# Altium schematic sheet bias.SchDoc
size A2
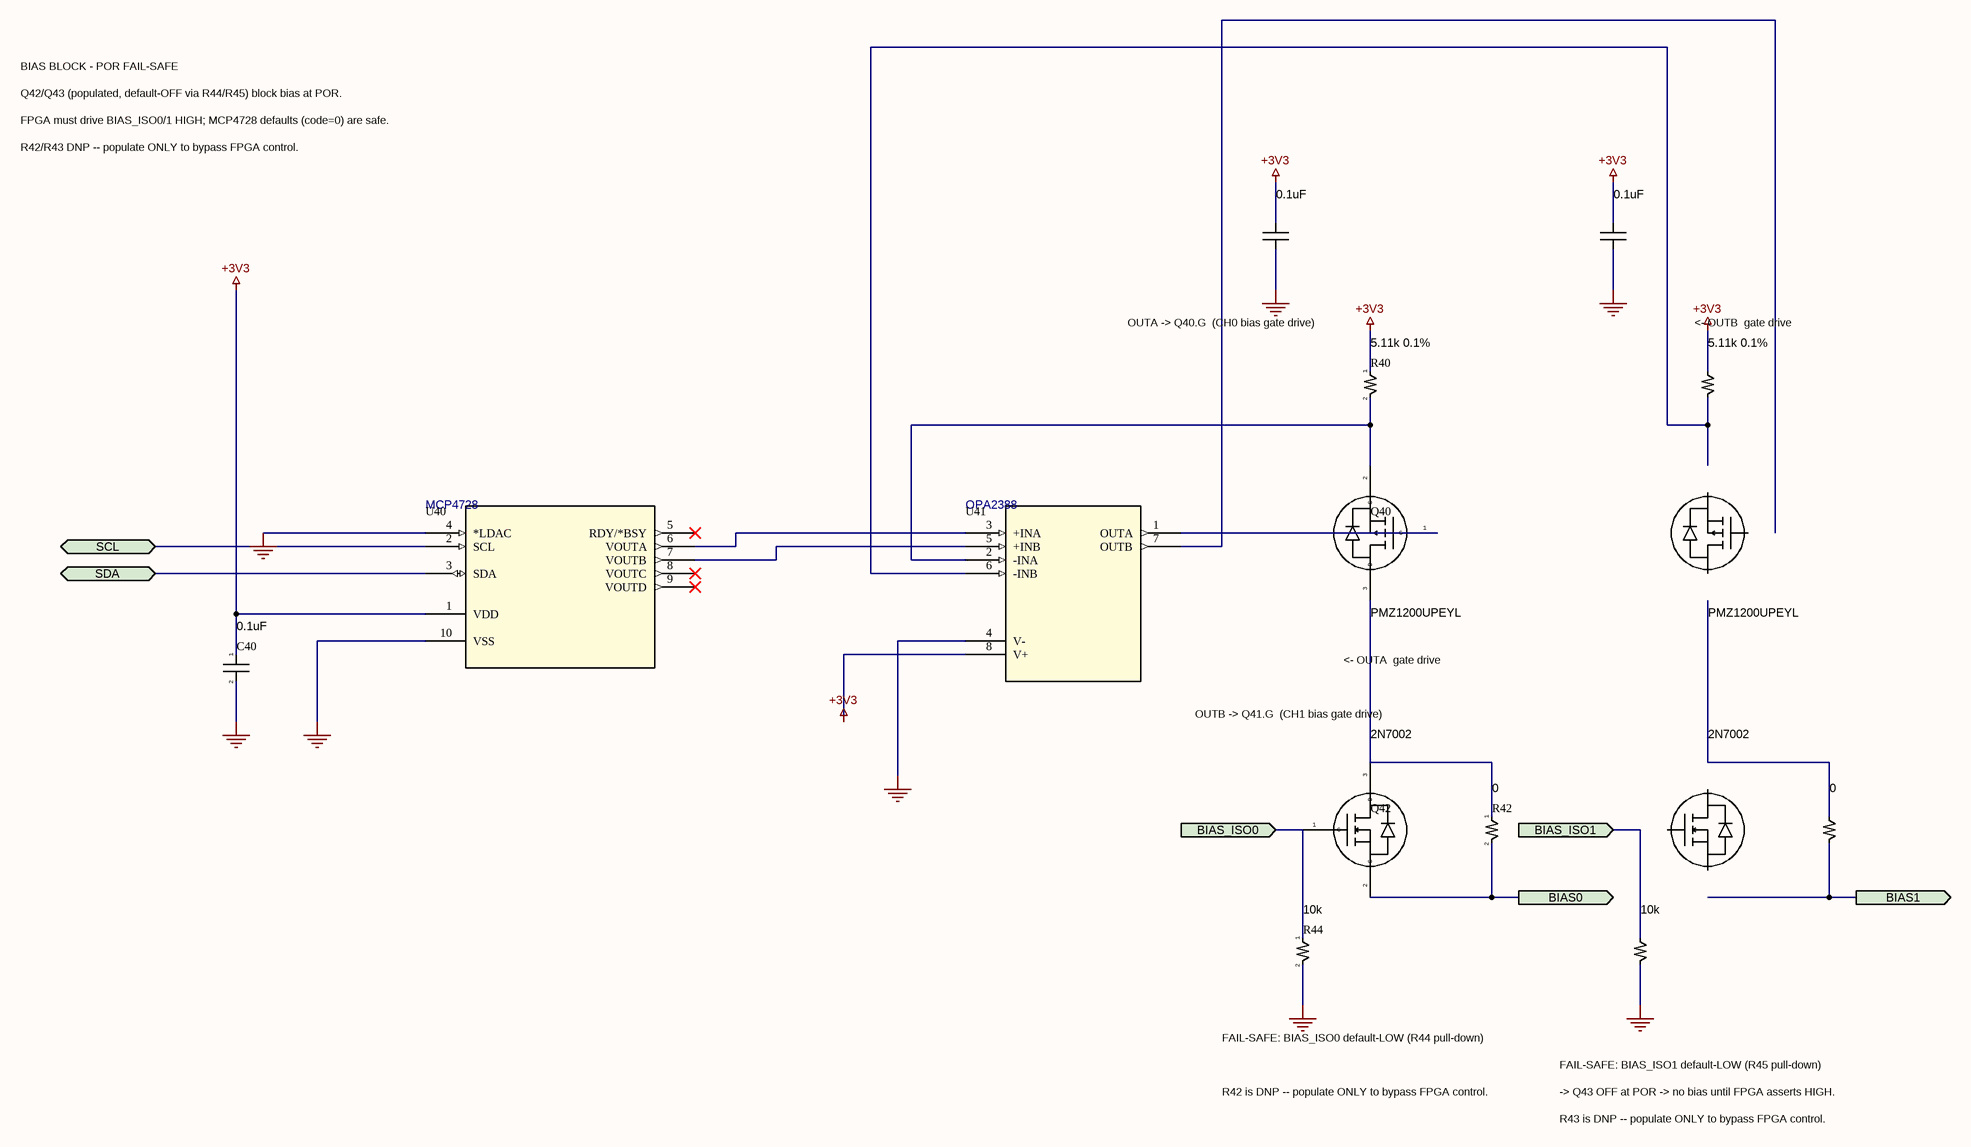
[diagram p0: bias.SchDoc]

## Parts
(Parts that share a designator on the sheet are numbered #1, #2 ... from top to bottom, then left to right.)
?#1  (no value)
?#2  (no value)
?#3  (no value)
?#4  (no value)
?#5  (no value)
?#6  (no value)
?#7  (no value)
C40  0.1uF
Q40  PMZ1200UPEYL
Q42  2N7002
R40  5.11k 0.1%
R42  0
R44  10k
U40  MCP4728
U41  OPA2388

## Ports
BIAS0 (out), BIAS1 (out), BIAS_ISO0 (in), BIAS_ISO1 (in), SCL (bidir), SDA (bidir)

## Nets
+3V3: C40.1 R40.1 U40.1(VDD) U41.8(V+)
GND: C40.2 R44.2 U40.4(*LDAC) U40.10(VSS) U41.4(V-)
BIAS0: Q42.2(S) R42.2 ; port BIAS0
BIAS_ISO0: Q42.1(G) R44.1 ; port BIAS_ISO0
SCL: U40.2(SCL) ; port SCL
SDA: U40.3(SDA) ; port SDA
NetQ40_1: Q40.1(G) U41.1(OUTA)
NetQ40_2: Q40.2(S) R40.2 U41.2(-INA)
NetQ40_3: Q40.3(D) Q42.3(D) R42.1
NetU40_6: U40.6(VOUTA) U41.3(+INA)
NetU40_7: U40.7(VOUTB) U41.5(+INB)

Not connected (* = marked no-connect by the designer): U40 5(RDY/*BSY)* 8(VOUTC)* 9(VOUTD)*; U41 6(-INB) 7(OUTB)

## Notes on the sheet
- BIAS BLOCK - POR FAIL-SAFE
- Q42/Q43 (populated, default-OFF via R44/R45) block bias at POR.
- FPGA must drive BIAS_ISO0/1 HIGH; MCP4728 defaults (code=0) are safe.
- R42/R43 DNP -- populate ONLY to bypass FPGA control.
- OUTA -> Q40.G  (CH0 bias gate drive)
- <- OUTB  gate drive
- OUTB -> Q41.G  (CH1 bias gate drive)
- <- OUTA  gate drive
- FAIL-SAFE: BIAS_ISO0 default-LOW (R44 pull-down)
- R42 is DNP -- populate ONLY to bypass FPGA control.
- FAIL-SAFE: BIAS_ISO1 default-LOW (R45 pull-down)
- -> Q43 OFF at POR -> no bias until FPGA asserts HIGH.
- R43 is DNP -- populate ONLY to bypass FPGA control.

## Library data of the parts
?#1 ?#2 = GRM155R71C104KA88D: CAP CER 0.1UF 16V X7R 0402
?#3 = TNPW06035K11BEEA: TNPW0603 5K11 0.1% T-9 ET1 e3
?#4 = PMZ1200UPEYL: 30 V P-channel Trench MOSFET, DFN1006-3 (SOT883)
?#5 Q42 = 2N7002: N-channel enhancement MOSFET (body diode)
  Q42: Footprint: SOT-23TO-236_318-08_ONS; Datasheet: 2N7002
?#6 = CRCW04020000Z0ED: D10/CRCW0402 0R0 ET7 e3
?#7 = CR0402-FX-1002GLF
C40 = GRM155R71C104KA88D: CAP CER 0.1UF 16V X7R 0402; Manufacturer_Name: Murata; Manufacturer_Part_Number: GRM155R71C104KA88D
Q40 = PMZ1200UPEYL: 30 V P-channel Trench MOSFET, DFN1006-3 (SOT883); Manufacturer: Nexperia; Footprint: PMZ1200UPEYL:DFN1006-3_SOT883; Datasheet: https://assets.nexperia.com/documents/data-sheet/PMZ1200UPE.pdf; MPN: PMZ1200UPEYL
R40 = TNPW06035K11BEEA: TNPW0603 5K11 0.1% T-9 ET1 e3; Manufacturer_Name: Vishay; Manufacturer_Part_Number: TNPW06035K11BEEA; Datasheet: https://www.vishay.com/doc?28758
R42 = CRCW04020000Z0ED: D10/CRCW0402 0R0 ET7 e3; Manufacturer_Name: Vishay; Manufacturer_Part_Number: CRCW04020000Z0ED
R44 = CR0402-FX-1002GLF: Manufacturer_Name: Bourns Electronics; Manufacturer_Part_Number: CR0402-FX-1002GLF
U40 = MCP4728T-EUN: Description; Manufacturer_Name: Microchip; Manufacturer_Part_Number: MCP4728T-E/UN; Copyright: Copyright (C) 2026 Ultra Librarian. All rights reserved.; RefDes: RefDes; Type: Type
U41 = OPA2388IDGKR: Dual, 10-MHz, CMOS, zero-drift, zero-crossover, true RRIO precision operational amplifier 8-VSSOP -40 to 125; Manufacturer_Name: Texas Instruments; Copyright: Copyright (C) 2026 Ultra Librarian. All rights reserved.; Manufacturer_Part_Number: OPA2388IDGKR; RefDes: RefDes; Type: Type